# EAGLE design Zaq_ISO (EAGLE 6.5.0)
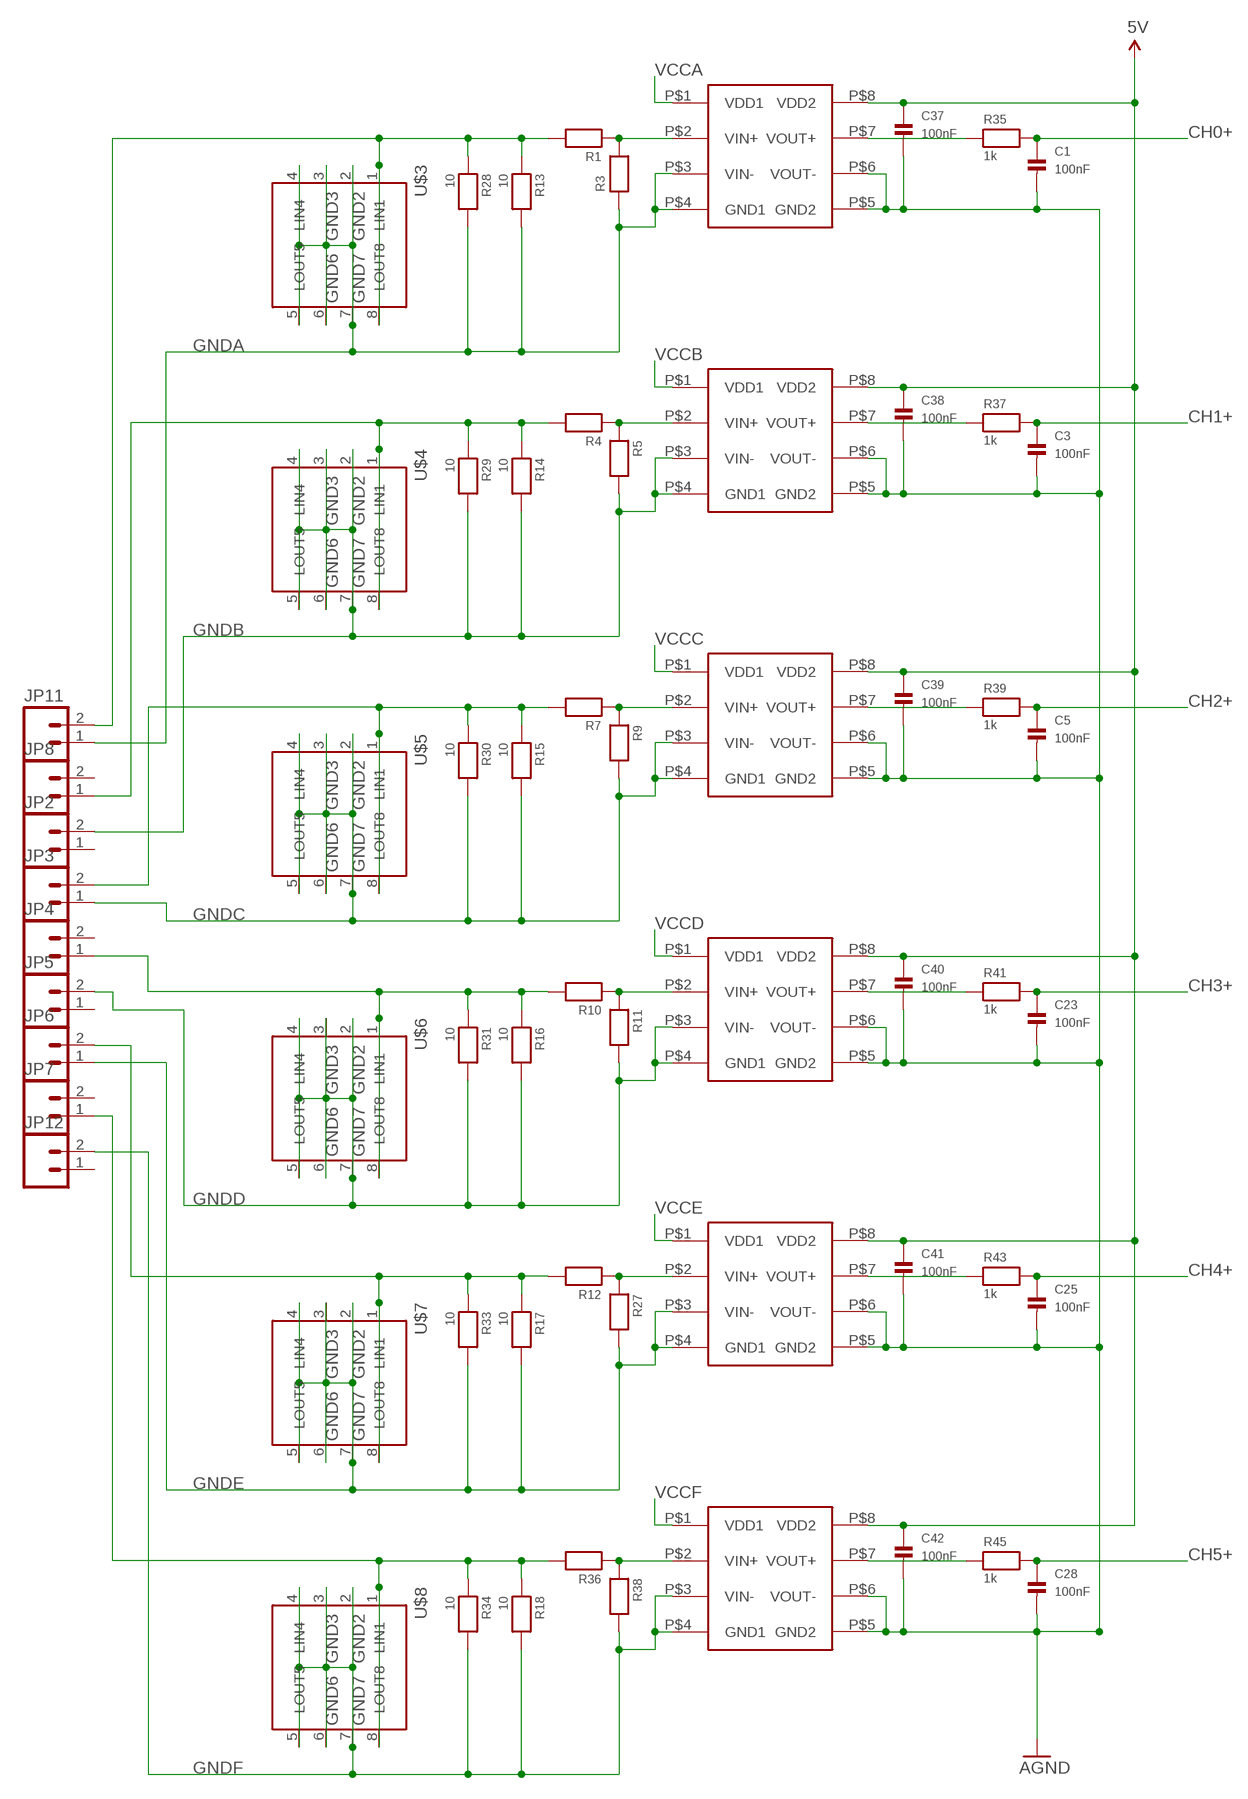
[diagram p0: schematic, sheet 1, part 1 of 2]
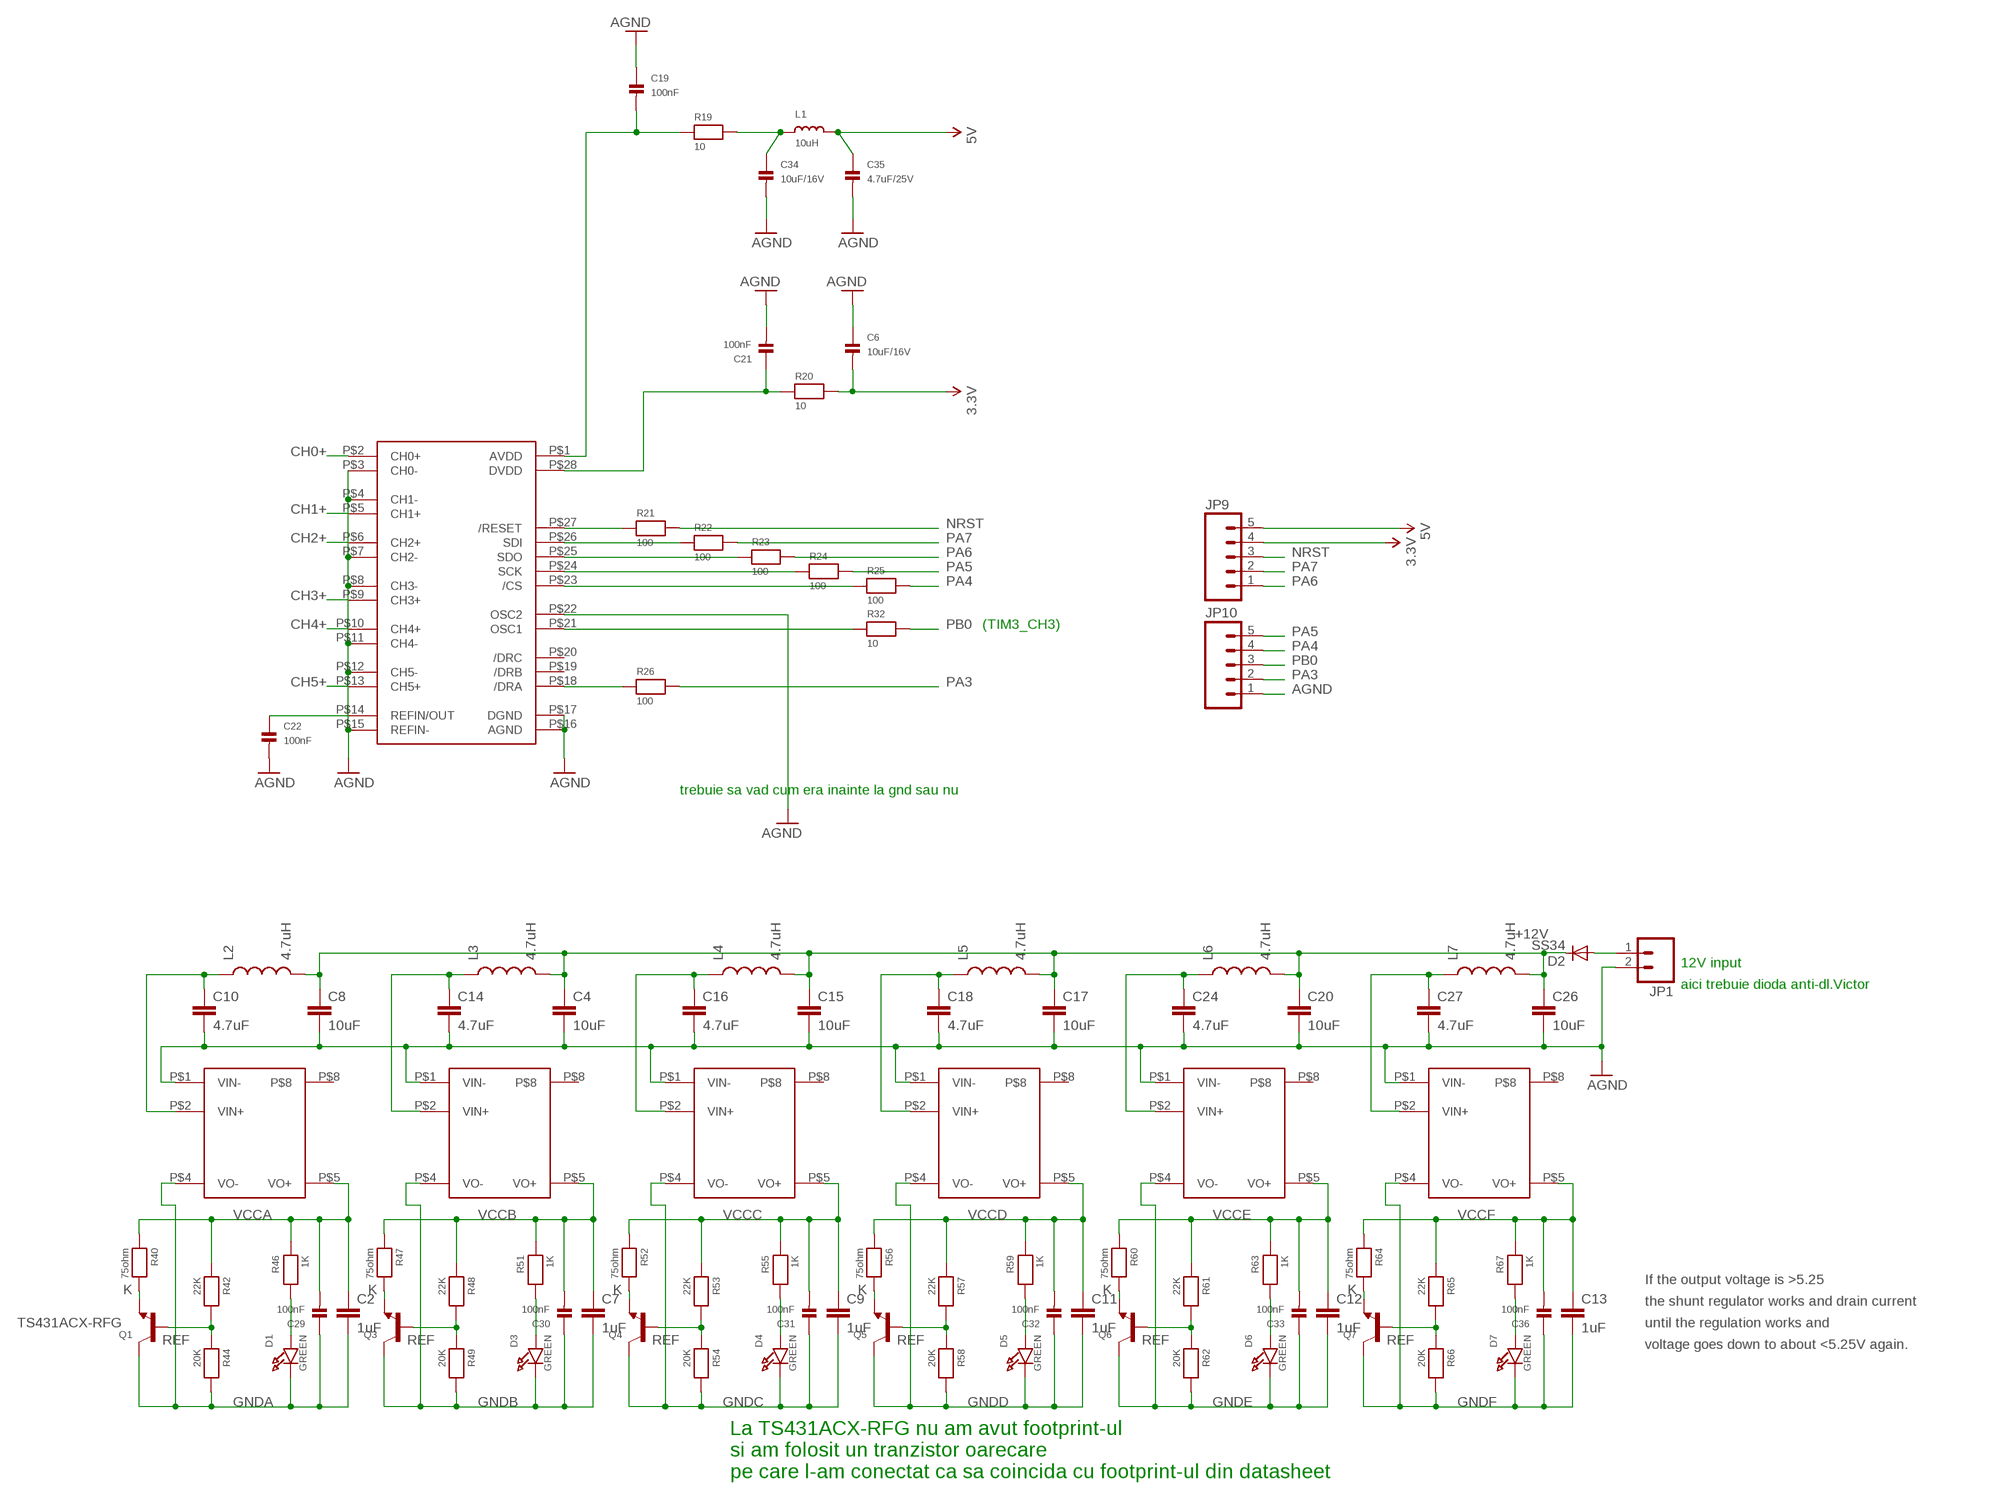
[diagram p1: schematic, sheet 1, part 2 of 2]

## Parts
.  MCP3903  [SSOP-28]
C1  100nF  CAP_CERAMIC_0805MP  [_0805MP]
C2  1uF  CAP1206  [1206]
C3  100nF  CAP_CERAMIC_0805MP  [_0805MP]
C4  10uF  CAP1206  [1206]
C5  100nF  CAP_CERAMIC_0805MP  [_0805MP]
C6  10uF/16V  CAP_CERAMIC_0805MP  [_0805MP]
C7  1uF  CAP1206  [1206]
C8  10uF  CAP1206  [1206]
C9  1uF  CAP1206  [1206]
C10  4.7uF  CAP1206  [1206]
C11  1uF  CAP1206  [1206]
C12  1uF  CAP1206  [1206]
C13  1uF  CAP1206  [1206]
C14  4.7uF  CAP1206  [1206]
C15  10uF  CAP1206  [1206]
C16  4.7uF  CAP1206  [1206]
C17  10uF  CAP1206  [1206]
C18  4.7uF  CAP1206  [1206]
C19  100nF  CAP_CERAMIC_0805MP  [_0805MP]
C20  10uF  CAP1206  [1206]
C21  100nF  CAP_CERAMIC_0805MP  [_0805MP]
C22  100nF  CAP_CERAMIC_0805MP  [_0805MP]
C23  100nF  CAP_CERAMIC_0805MP  [_0805MP]
C24  4.7uF  CAP1206  [1206]
C25  100nF  CAP_CERAMIC_0805MP  [_0805MP]
C26  10uF  CAP1206  [1206]
C27  4.7uF  CAP1206  [1206]
C28  100nF  CAP_CERAMIC_0805MP  [_0805MP]
C29  100nF  CAP_CERAMIC_0805MP  [_0805MP]
C30  100nF  CAP_CERAMIC_0805MP  [_0805MP]
C31  100nF  CAP_CERAMIC_0805MP  [_0805MP]
C32  100nF  CAP_CERAMIC_0805MP  [_0805MP]
C33  100nF  CAP_CERAMIC_0805MP  [_0805MP]
C34  10uF/16V  CAP_CERAMIC_0805MP  [_0805MP]
C35  4.7uF/25V  CAP_CERAMIC_0805MP  [_0805MP]
C36  100nF  CAP_CERAMIC_0805MP  [_0805MP]
C37  100nF  CAP_CERAMIC_0805MP  [_0805MP]
C38  100nF  CAP_CERAMIC_0805MP  [_0805MP]
C39  100nF  CAP_CERAMIC_0805MP  [_0805MP]
C40  100nF  CAP_CERAMIC_0805MP  [_0805MP]
C41  100nF  CAP_CERAMIC_0805MP  [_0805MP]
C42  100nF  CAP_CERAMIC_0805MP  [_0805MP]
D1  GREEN  LED0805_NOOUTLINE  [CHIPLED_0805_NOOUTLINE]
D2  SS34  DIODE-SMC  [SMC]
D3  GREEN  LED0805_NOOUTLINE  [CHIPLED_0805_NOOUTLINE]
D4  GREEN  LED0805_NOOUTLINE  [CHIPLED_0805_NOOUTLINE]
D5  GREEN  LED0805_NOOUTLINE  [CHIPLED_0805_NOOUTLINE]
D6  GREEN  LED0805_NOOUTLINE  [CHIPLED_0805_NOOUTLINE]
D7  GREEN  LED0805_NOOUTLINE  [CHIPLED_0805_NOOUTLINE]
JP1  M025MM  [SCREWTERMINAL-5MM-2]
JP2  M025MM  [SCREWTERMINAL-5MM-2]
JP3  M025MM  [SCREWTERMINAL-5MM-2]
JP4  M025MM  [SCREWTERMINAL-5MM-2]
JP5  M025MM  [SCREWTERMINAL-5MM-2]
JP6  M025MM  [SCREWTERMINAL-5MM-2]
JP7  M025MM  [SCREWTERMINAL-5MM-2]
JP8  M025MM  [SCREWTERMINAL-5MM-2]
JP9  M05PTH_LONGPADS  [1X05_LONGPADS]
JP10  M05PTH_LONGPADS  [1X05_LONGPADS]
JP11  M025MM  [SCREWTERMINAL-5MM-2]
JP12  M025MM  [SCREWTERMINAL-5MM-2]
L1  10uH  INDUCTOR_0805MP  [_0805MP]
L2  4.7uH  INDUCTOR1210  [1210]
L3  4.7uH  INDUCTOR1210  [1210]
L4  4.7uH  INDUCTOR1210  [1210]
L5  4.7uH  INDUCTOR1210  [1210]
L6  4.7uH  INDUCTOR1210  [1210]
L7  4.7uH  INDUCTOR1210  [1210]
Q1  TRANSISTOR_NPNWAVE  [SOT23-W]
Q3  TRANSISTOR_NPNWAVE  [SOT23-W]
Q4  TRANSISTOR_NPNWAVE  [SOT23-W]
Q5  TRANSISTOR_NPNWAVE  [SOT23-W]
Q6  TRANSISTOR_NPNWAVE  [SOT23-W]
Q7  TRANSISTOR_NPNWAVE  [SOT23-W]
R1  RESISTOR_0805MP  [_0805MP]
R3  RESISTOR_0805MP  [_0805MP]
R4  RESISTOR_0805MP  [_0805MP]
R5  RESISTOR_0805MP  [_0805MP]
R7  RESISTOR_0805MP  [_0805MP]
R9  RESISTOR_0805MP  [_0805MP]
R10  RESISTOR_0805MP  [_0805MP]
R11  RESISTOR_0805MP  [_0805MP]
R12  RESISTOR_0805MP  [_0805MP]
R13  10  RESISTOR1206  [1206]
R14  10  RESISTOR1206  [1206]
R15  10  RESISTOR1206  [1206]
R16  10  RESISTOR1206  [1206]
R17  10  RESISTOR1206  [1206]
R18  10  RESISTOR1206  [1206]
R19  10  RESISTOR_0805MP  [_0805MP]
R20  10  RESISTOR_0805MP  [_0805MP]
R21  100  RESISTOR_0805MP  [_0805MP]
R22  100  RESISTOR_0805MP  [_0805MP]
R23  100  RESISTOR_0805MP  [_0805MP]
R24  100  RESISTOR_0805MP  [_0805MP]
R25  100  RESISTOR_0805MP  [_0805MP]
R26  100  RESISTOR_0805MP  [_0805MP]
R27  RESISTOR_0805MP  [_0805MP]
R28  10  RESISTOR1206  [1206]
R29  10  RESISTOR1206  [1206]
R30  10  RESISTOR1206  [1206]
R31  10  RESISTOR1206  [1206]
R32  10  RESISTOR_0805MP  [_0805MP]
R33  10  RESISTOR1206  [1206]
R34  10  RESISTOR1206  [1206]
R35  1k  RESISTOR_0805MP  [_0805MP]
R36  RESISTOR_0805MP  [_0805MP]
R37  1k  RESISTOR_0805MP  [_0805MP]
R38  RESISTOR_0805MP  [_0805MP]
R39  1k  RESISTOR_0805MP  [_0805MP]
R40  75ohm  RESISTOR_0805MP  [_0805MP]
R41  1k  RESISTOR_0805MP  [_0805MP]
R42  22K  RESISTOR_0805MP  [_0805MP]
R43  1k  RESISTOR_0805MP  [_0805MP]
R44  20K  RESISTOR_0805MP  [_0805MP]
R45  1k  RESISTOR_0805MP  [_0805MP]
R46  1K  RESISTOR_0805MP  [_0805MP]
R47  75ohm  RESISTOR_0805MP  [_0805MP]
R48  22K  RESISTOR_0805MP  [_0805MP]
R49  20K  RESISTOR_0805MP  [_0805MP]
R51  1K  RESISTOR_0805MP  [_0805MP]
R52  75ohm  RESISTOR_0805MP  [_0805MP]
R53  22K  RESISTOR_0805MP  [_0805MP]
R54  20K  RESISTOR_0805MP  [_0805MP]
R55  1K  RESISTOR_0805MP  [_0805MP]
R56  75ohm  RESISTOR_0805MP  [_0805MP]
R57  22K  RESISTOR_0805MP  [_0805MP]
R58  20K  RESISTOR_0805MP  [_0805MP]
R59  1K  RESISTOR_0805MP  [_0805MP]
R60  75ohm  RESISTOR_0805MP  [_0805MP]
R61  22K  RESISTOR_0805MP  [_0805MP]
R62  20K  RESISTOR_0805MP  [_0805MP]
R63  1K  RESISTOR_0805MP  [_0805MP]
R64  75ohm  RESISTOR_0805MP  [_0805MP]
R65  22K  RESISTOR_0805MP  [_0805MP]
R66  20K  RESISTOR_0805MP  [_0805MP]
R67  1K  RESISTOR_0805MP  [_0805MP]
U$2  AMC1200SDUB  [SOP]
U$3  LC03_3V3  [SO8]
U$4  LC03_3V3  [SO8]
U$5  LC03_3V3  [SO8]
U$6  LC03_3V3  [SO8]
U$7  LC03_3V3  [SO8]
U$8  LC03_3V3  [SO8]
U$9  AMC1200SDUB  [SOP]
U$12  AMC1200SDUB  [SOP]
U$16  AMC1200SDUB  [SOP]
U$17  AM1LS-NJZ  [AM1LS-JZ]
U$18  AMC1200SDUB  [SOP]
U$19  AMC1200SDUB  [SOP]
U$20  AM1LS-NJZ  [AM1LS-JZ]
U$22  AM1LS-NJZ  [AM1LS-JZ]
U$23  AM1LS-NJZ  [AM1LS-JZ]
U$24  AM1LS-NJZ  [AM1LS-JZ]
U$25  AM1LS-NJZ  [AM1LS-JZ]

## Nets
3.3V: C6.2 JP9.4 R20.2
5V: C35.1 C37.1 C38.1 C39.1 C40.1 C41.1 C42.1 JP9.5 L1.2 U$2.P$8(VDD2) U$9.P$8(VDD2) U$12.P$8(VDD2) U$16.P$8(VDD2) U$18.P$8(VDD2) U$19.P$8(VDD2)
+12V: C4.1 C8.1 C15.1 C17.1 C20.1 C26.1 D2.C L2.2 L3.2 L4.2 L5.2 L6.2 L7.2
AGND: ..P$3(CH0-) ..P$4(CH1-) ..P$7(CH2-) ..P$8(CH3-) ..P$11(CH4-) ..P$12(CH5-) ..P$15(REFIN-) ..P$16(AGND) ..P$17(DGND) ..P$22(OSC2) C1.2 C3.2 C4.2 C5.2 C6.1 C8.2 C10.2 C14.2 C15.2 C16.2 C17.2 C18.2 C19.1 C20.2 C21.2 C22.2 C23.2 C24.2 C25.2 C26.2 C27.2 C28.2 C34.2 C35.2 C37.2 C38.2 C39.2 C40.2 C41.2 C42.2 JP1.2 JP10.1 U$2.P$5(GND2) U$2.P$6(VOUT-) U$9.P$5(GND2) U$9.P$6(VOUT-) U$12.P$5(GND2) U$12.P$6(VOUT-) U$16.P$5(GND2) U$16.P$6(VOUT-) U$17.P$1(VIN-) U$18.P$5(GND2) U$18.P$6(VOUT-) U$19.P$5(GND2) U$19.P$6(VOUT-) U$20.P$1(VIN-) U$22.P$1(VIN-) U$23.P$1(VIN-) U$24.P$1(VIN-) U$25.P$1(VIN-)
CH0+: ..P$2(CH0+) C1.1 R35.2
CH1+: ..P$5(CH1+) C3.1 R37.2
CH2+: ..P$6(CH2+) C5.1 R39.2
CH3+: ..P$9(CH3+) C23.1 R41.2
CH4+: ..P$10(CH4+) C25.1 R43.2
CH5+: ..P$13(CH5+) C28.1 R45.2
GNDA: C2.2 C29.1 D1.C JP11.1 Q1.3(C) R3.1 R13.2 R28.2 R44.2 U$2.P$3(VIN-) U$2.P$4(GND1) U$3.2(GND_2) U$3.3(GND_3) U$3.4(LIN4) U$3.5(LOUT5) U$3.6(GND_6) U$3.7(GND_7) U$17.P$4(VO-)
GNDB: C7.2 C30.1 D3.C JP2.2 Q3.3(C) R5.2 R14.2 R29.2 R49.2 U$4.2(GND_2) U$4.3(GND_3) U$4.4(LIN4) U$4.5(LOUT5) U$4.6(GND_6) U$4.7(GND_7) U$9.P$3(VIN-) U$9.P$4(GND1) U$20.P$4(VO-)
GNDC: C9.2 C31.1 D4.C JP3.1 Q4.3(C) R9.2 R15.2 R30.2 R54.2 U$5.2(GND_2) U$5.3(GND_3) U$5.4(LIN4) U$5.5(LOUT5) U$5.6(GND_6) U$5.7(GND_7) U$12.P$3(VIN-) U$12.P$4(GND1) U$22.P$4(VO-)
GNDD: C11.2 C32.1 D5.C JP5.2 Q5.3(C) R11.2 R16.2 R31.2 R58.2 U$6.2(GND_2) U$6.3(GND_3) U$6.4(LIN4) U$6.5(LOUT5) U$6.6(GND_6) U$6.7(GND_7) U$16.P$3(VIN-) U$16.P$4(GND1) U$23.P$4(VO-)
GNDE: C12.2 C33.1 D6.C JP6.1 Q6.3(C) R17.2 R27.2 R33.2 R62.2 U$7.2(GND_2) U$7.3(GND_3) U$7.4(LIN4) U$7.5(LOUT5) U$7.6(GND_6) U$7.7(GND_7) U$18.P$3(VIN-) U$18.P$4(GND1) U$24.P$4(VO-)
GNDF: C13.2 C36.1 D7.C JP12.2 Q7.3(C) R18.2 R34.2 R38.2 R66.2 U$8.2(GND_2) U$8.3(GND_3) U$8.4(LIN4) U$8.5(LOUT5) U$8.6(GND_6) U$8.7(GND_7) U$19.P$3(VIN-) U$19.P$4(GND1) U$25.P$4(VO-)
N$3: ..P$21(OSC1) R32.1
N$5: ..P$1(AVDD) C19.2 R19.1
N$7: Q1.1(B) R42.2 R44.1
N$8: ..P$14(REFIN/OUT) C22.1
N$9: ..P$28(DVDD) C21.1 R20.1
N$10: ..P$27(/RESET) R21.1
N$11: ..P$26(SDI) R22.1
N$12: ..P$25(SDO) R23.1
N$13: ..P$24(SCK) R24.1
N$14: ..P$23(/CS) R25.1
N$15: ..P$18(/DRA) R26.1
N$16: Q1.2(E) R40.2
N$17: C14.1 L3.1 U$20.P$2(VIN+)
N$18: D1.A R46.2
N$22: R45.1 U$19.P$7(VOUT+)
N$23: R43.1 U$18.P$7(VOUT+)
N$24: R41.1 U$16.P$7(VOUT+)
N$25: R39.1 U$12.P$7(VOUT+)
N$28: C34.1 L1.1 R19.2
N$29: R1.1 R3.2 U$2.P$2(VIN+)
N$30: R4.1 R5.1 U$9.P$2(VIN+)
N$31: R7.1 R9.1 U$12.P$2(VIN+)
N$32: R10.1 R11.1 U$16.P$2(VIN+)
N$33: R37.1 U$9.P$7(VOUT+)
N$34: R35.1 U$2.P$7(VOUT+)
N$35: Q3.1(B) R48.2 R49.1
N$36: Q3.2(E) R47.2
N$37: D3.A R51.2
N$39: R12.1 R27.1 U$18.P$2(VIN+)
N$40: R36.1 R38.1 U$19.P$2(VIN+)
N$42: Q4.1(B) R53.2 R54.1
N$43: Q4.2(E) R52.2
N$44: D4.A R55.2
N$46: D2.A JP1.1
N$47: Q5.1(B) R57.2 R58.1
N$48: Q5.2(E) R56.2
N$49: D5.A R59.2
N$51: JP7.1 R18.1 R34.1 R36.2 U$8.1(LIN1) U$8.8(LOUT8)
N$53: JP6.2 R12.2 R17.1 R33.1 U$7.1(LIN1) U$7.8(LOUT8)
N$54: JP4.1 R10.2 R16.1 R31.1 U$6.1(LIN1) U$6.8(LOUT8)
N$55: Q6.1(B) R61.2 R62.1
N$56: Q6.2(E) R60.2
N$57: JP3.2 R7.2 R15.1 R30.1 U$5.1(LIN1) U$5.8(LOUT8)
N$58: JP8.1 R4.2 R14.1 R29.1 U$4.1(LIN1) U$4.8(LOUT8)
N$59: D6.A R63.2
N$60: JP11.2 R1.2 R13.1 R28.1 U$3.1(LIN1) U$3.8(LOUT8)
N$63: Q7.1(B) R65.2 R66.1
N$64: Q7.2(E) R64.2
N$65: D7.A R67.2
N$74: C27.1 L7.1 U$25.P$2(VIN+)
N$76: C24.1 L6.1 U$24.P$2(VIN+)
N$78: C18.1 L5.1 U$23.P$2(VIN+)
N$80: C10.1 L2.1 U$17.P$2(VIN+)
N$82: C16.1 L4.1 U$22.P$2(VIN+)
NRST: JP9.3 R21.2
PA3: JP10.2 R26.2
PA4: JP10.4 R25.2
PA5: JP10.5 R24.2
PA6: JP9.1 R23.2
PA7: JP9.2 R22.2
PB0: JP10.3 R32.2
VCCA: C2.1 C29.2 R40.1 R42.1 R46.1 U$2.P$1(VDD1) U$17.P$5(VO+)
VCCB: C7.1 C30.2 R47.1 R48.1 R51.1 U$9.P$1(VDD1) U$20.P$5(VO+)
VCCC: C9.1 C31.2 R52.1 R53.1 R55.1 U$12.P$1(VDD1) U$22.P$5(VO+)
VCCD: C11.1 C32.2 R56.1 R57.1 R59.1 U$16.P$1(VDD1) U$23.P$5(VO+)
VCCE: C12.1 C33.2 R60.1 R61.1 R63.1 U$18.P$1(VDD1) U$24.P$5(VO+)
VCCF: C13.1 C36.2 R64.1 R65.1 R67.1 U$19.P$1(VDD1) U$25.P$5(VO+)
Unconnected: ..P$19(/DRB) ..P$20(/DRC) JP2.1 JP4.2 JP5.1 JP7.2 JP8.2 JP12.1 U$17.P$8 U$20.P$8 U$22.P$8 U$23.P$8 U$24.P$8 U$25.P$8

## Notes on the sheet
- (TIM3_CH3)
- trebuie sa vad cum era inainte la gnd sau nu
- 12V input
- aici trebuie dioda anti-dl.Victor
- K | K | K | K | K | K | If the output voltage is >5.25
- the shunt regulator works and drain current
- TS431ACX-RFG | until the regulation works and
- REF | REF | REF | REF | REF | REF
- voltage goes down to about <5.25V again.
- La TS431ACX-RFG nu am avut footprint-ul
- si am folosit un tranzistor oarecare
- pe care l-am conectat ca sa coincida cu footprint-ul din datasheet

## Library data of the parts
. = ecgparts:MCP3903
C1 C3 C5 C6 C19 C21-C23 C25 C28-C42 = microbuilder:CAP_CERAMIC: Ceramic Capacitors 0402 - 0402 Surface Mount Capacitors 16pF 50V 5% [Digikey: 445-4899-2-ND] 18pF 50V 5% [Digikey: 490-1281-2-ND] 22pF 50V 5% [Digikey: 490-1283-2-ND] 68pF 50V 5% [Digikey: 490-1289-2-ND] 0.1uF 10V 10% [Digikey: 490-1318-2-ND] 1.0uF 6.3V 10% [Digikey: 490-1320-2-ND] 0603 - 0603 Surface Mount Capacitors 16 pF 50V 5% [Digikey: 445-5051-2-ND] 22 pF 50V [Digikey: PCC220ACVTR-ND] 33 pF 50V 5% [Digikey: 490-1415-1-ND] 56pF 50V 5% [Digikey: 490-1421-1-ND] 220pF 50V 5% [Digikey: 445-1285-1-ND] 680 pF 50V 2200 pF 50V 5% C0G [Digikey: 445-1297-1-ND] 5600 pF 100V 5% X7R [Digikey: 478-3711-1-ND] 0.1 µF 25V 10% [Digikey: PCC2277TR-ND] 0.22 µF 16V 10% X7R [Digikey: 445-1318-1-ND] 1.0 µF 25V 10% [Digikey: 445-5146-2-ND] 0603 - RF Specific 3pF 250V +/-0.1pF RF [Digikey: 712-1347-1-ND] 18 pF 250V 5% [Digikey: 478-3505-1-ND or 712-1322-1-ND] 56 pF 250V 5% C0G RF [Digikey: 490-4867-1-ND] 68 pF 250V RF [Digikey: 490-4868-1-ND] 0805 - 0805 Surface Mount Capacitors 220 pF 250V 2% RF Ceramic Capacitor [Digikey: 712-1398-1-ND] 1000 pF 50V 2% NP0 Ceramic Capacitor [Digikey: 478-3760-1-ND] 0.1 µF 25V 10% Ceramic Capacitor [Digikey: PCC1828TR-ND] 1.0 µF 16V 10% Ceramic Capacitor[Digikey: 490-1691-2-ND] 10.0 µF 10V 10% Ceramic Capacitor[Digikey: 709-1228-1-ND] 10.0 uF 16V 10% Ceramic Capacitor [Digikey: 478-5165-2-ND] 47 uF 6.3V 20% Ceramic Capacitor [Digikey: 587-1779-1-ND or 399-5506-1-ND] 1206 - 1206 Surface Mount Capacitors 47uF 10V 20% Ceramic Capacitor [Digikey: 490-5528-1-ND or 399-5508-1-ND or 445-6010-1-ND] 100uF 6.3V -20%, +80% Y5V Ceramic Capacitor (Digikey: 490-4512-1-ND, Mouser: 81-GRM31CF50J107ZE1L)
C2 C4 C7-C18 C20 C24 C26 C27 = SparkFun-Passives:CAP: Capacitor Standard 0603 ceramic capacitor, and 0.1" leaded capacitor.
D1 D3-D7 = microbuilder:LED: LED 0603 - 0603 Surface Mount Package 2mA: Green LED - Low Power (3.9mcd, 2ma, 1.7Vf) - Digikey: 475-2709-2-ND Orange LED - Low Power (9.8mcd, 2ma, 1.8Vf) - Digikey: 475-1194-2-ND Red LED - Low Power (5mcd, 2ma, 1.8Vf) - Digikey: 475-1195-2-ND Yellow LED - Low Power (7mcd, 2ma, 1.8Vf) - Digikey: 475-1196-2-ND 5mA: Blue LED - Low Power (17mcd, 5ma, 2.9Vf) - Digikey: LNJ937W8CRACT-ND 0805 - 0805 Surface Mount Package 2mA: Red LED (8.8mcd, 2mA, 1.8Vf, Clear) - Low Power [Digikey: 475-2510-1-ND] Green LED (5mcd, 2mA, 1.8Vf, Clear) - Low Power [Digikey: 475-2730-1-ND] Yellow LED (11.3mcd, 2mA, 1.8Vf, Clear) - Low Power [Digikey: 475-2555-1-ND] 20mA: Red LED (104mcd, 20mA, Diffused) - LS R976 [Digikey: 475-1278-6-ND] Red LED (12mcd, 20mA, 2.0Vf, Clear) - APT2012EC [Digikey: 754-1128-1-ND] Green LED (15mcd, 20mA, 2.2Vf, Clear) - APT2012GC [Digikey: 754-1131-1-ND] Orange LED (160mcd, 20mA, 2.1Vf, Clear) - APT2012SECK [Digikey: 754-1130-1-ND] 1206 - 1206 Surface Mount Package Green LED (26mcd, 20mA, Diffused) - LG N971 [Digikey: 475-1407-6-ND] Red LED (15mcd, 20mA, Diffused) - LH N974 [Digikey: 475-1416-6-ND]
D2 = diode:DIODE-: DIODE
JP1-JP8 JP11 JP12 = SparkFun-Connectors:M02: Header 2 Standard 2-pin 0.1" header. Use with straight break away headers (SKU : PRT-00116), right angle break away headers (PRT-00553), swiss pins (PRT-00743), machine pins (PRT-00117), and female headers (PRT-00115). Molex polarized connector foot print use with SKU : PRT-08233 with associated crimp pins and housings.
JP9 JP10 = SparkFun-Connectors:M05: Header 5 Standard 5-pin 0.1" header. Use with straight break away headers (SKU : PRT-00116), right angle break away headers (PRT-00553), swiss pins (PRT-00743), machine pins (PRT-00117), and female headers (PRT-00115). Molex polarized connector foot print use with SKU : PRT-08230 with associated crimp pins and housings.
L1 = microbuilder:INDUCTOR: Inductors
L2-L7 = SparkFun-Passives:INDUCTOR: Inductors
Q1 Q3-Q7 = microbuilder:TRANSISTOR_NPN: NPN Transistor Transistor (NPN) 500mA 45V - BC817 [Digikey: 568-1631-1-ND] Transistor (NPN) 500mA 45V - BC817,215 [Mouser: 771-BC817-T/R] SOT23-R - SOT23 footprint optimised for use with solder paste and reflow ovens. SOT23-W - SOT23 footprint optimised for hand-soldering (larger pads).
R1 R3-R5 R7 R9-R49 R51-R67 = microbuilder:RESISTOR: Resistors 0402 - 0402 Surface Mount Package 22 Ohm 1% 1/16W [Digikey: 311-22.0LRTR-ND] 33 Ohm 5% 1/16W 1.0K 5% 1/16W 1.5K 5% 1/16W 2.0K 1% 1/16W 10.0K 1% 1/16W [Digikey: 311-10.0KLRTR-ND] 10.0K 5% 1/16W [Digikey: RMCF0402JT10K0TR-ND] 12.1K 1% 1/16W [Digikey: 311-22.0LRTR-ND] 100.0K 5% 1/16W 0603 - 0603 Surface Mount Package 0 Ohm 1/10 Watt 1% Resistor 15 Ohm 1/10 Watt 1% Resistor 33 Ohm 1/10 Watt 1% Resistor 49.9 Ohm 1/10 Watt 1% Resistor 100 Ohm 1/10 Watt 1% Resistor 150 Ohm 1/10 Watt 1% Resistor 240 Ohm 1/10 Watt 1% Resistor 390 Ohm 1/10 Watt 1% Resistor 560 Ohm 1/10 Watt 1% Resistor 680 Ohm 1/10 Watt 1% Resistor 750 Ohm 1/10 Watt 1% Resistor 1.0K Ohm 1/10 Watt 1% Resistor 1.5K Ohm 1/10 Watt 1% Resistor 2.0K Ohm 1/10 Watt 1% Resistor 2.2K Ohm 1/10 Watt 1% Resistor 3.3K Ohm 1/10 Watt 1% Resistor 4.7K Ohm 1/10 Watt 1% Resistor 10.0K Ohm 1/10 Watt 1% Resistor 12.0K Ohm 1/10 Watt 1% Resistor 12.1K Ohm 1/10 Watt 1% Resistor 20.0K Ohm 1/10 Watt 1% Resistor 33.0K Ohm 1/10 Watt 1% Resistor 100.0K Ohm 1/10 Watt 1% Resistor 0805 - 0805 Surface Mount Package 0 Ohm 1/8 Watt 1% Resistor 33 Ohm 1/8 Watt 1% Resistor 100 Ohm 1/8 Watt 1% Resistor 150 Ohm 1/8 Watt 1% Resistor 200 Ohm 1/8 Watt 1% Resistor 240 Ohm 1/8 Watt 1% Resistor 330 Ohm 1/8 Watt 1% Resistor 390 Ohm 1/8 Watt 1% Resistor 470 Ohm 1/8 Watt 1% Resistor 1.0K Ohm 1/8 Watt 1% Resistor 1.5K Ohm 1/8 Watt 1% Resistor 2.0K Ohm 1/8 Watt 1% Resistor 4.7K Ohm 1/8 Watt 1% Resistor 5.1K Ohm 1/8 Watt 1% Resistor 5.6K Ohm 1/8 Watt 1% Resistor 10.0K Ohm 1/8 Watt 1% Resistor 22.0K Ohm 1/8 Watt 1% Resistor 33.0K Ohm 1/8 Watt 1% Resistor 100K Ohm 1/8 Watt 1% Resistor 1206 - 1206 Surface Mount Package 2012 - 2010 Surface Mount Package 0.11 Ohm 1/2 Watt 1% Resistor - Digikey: RHM.11UCT-ND
U$2 U$9 U$12 U$16 U$18 U$19 = LibrarieEagleNedelcu:AMC1200SDUB
U$3-U$8 = LC03_3v3:LC03_3V3
U$17 U$20 U$22-U$25 = LibrarieEagleNedelcu:AM1LS-NJZ

## Board
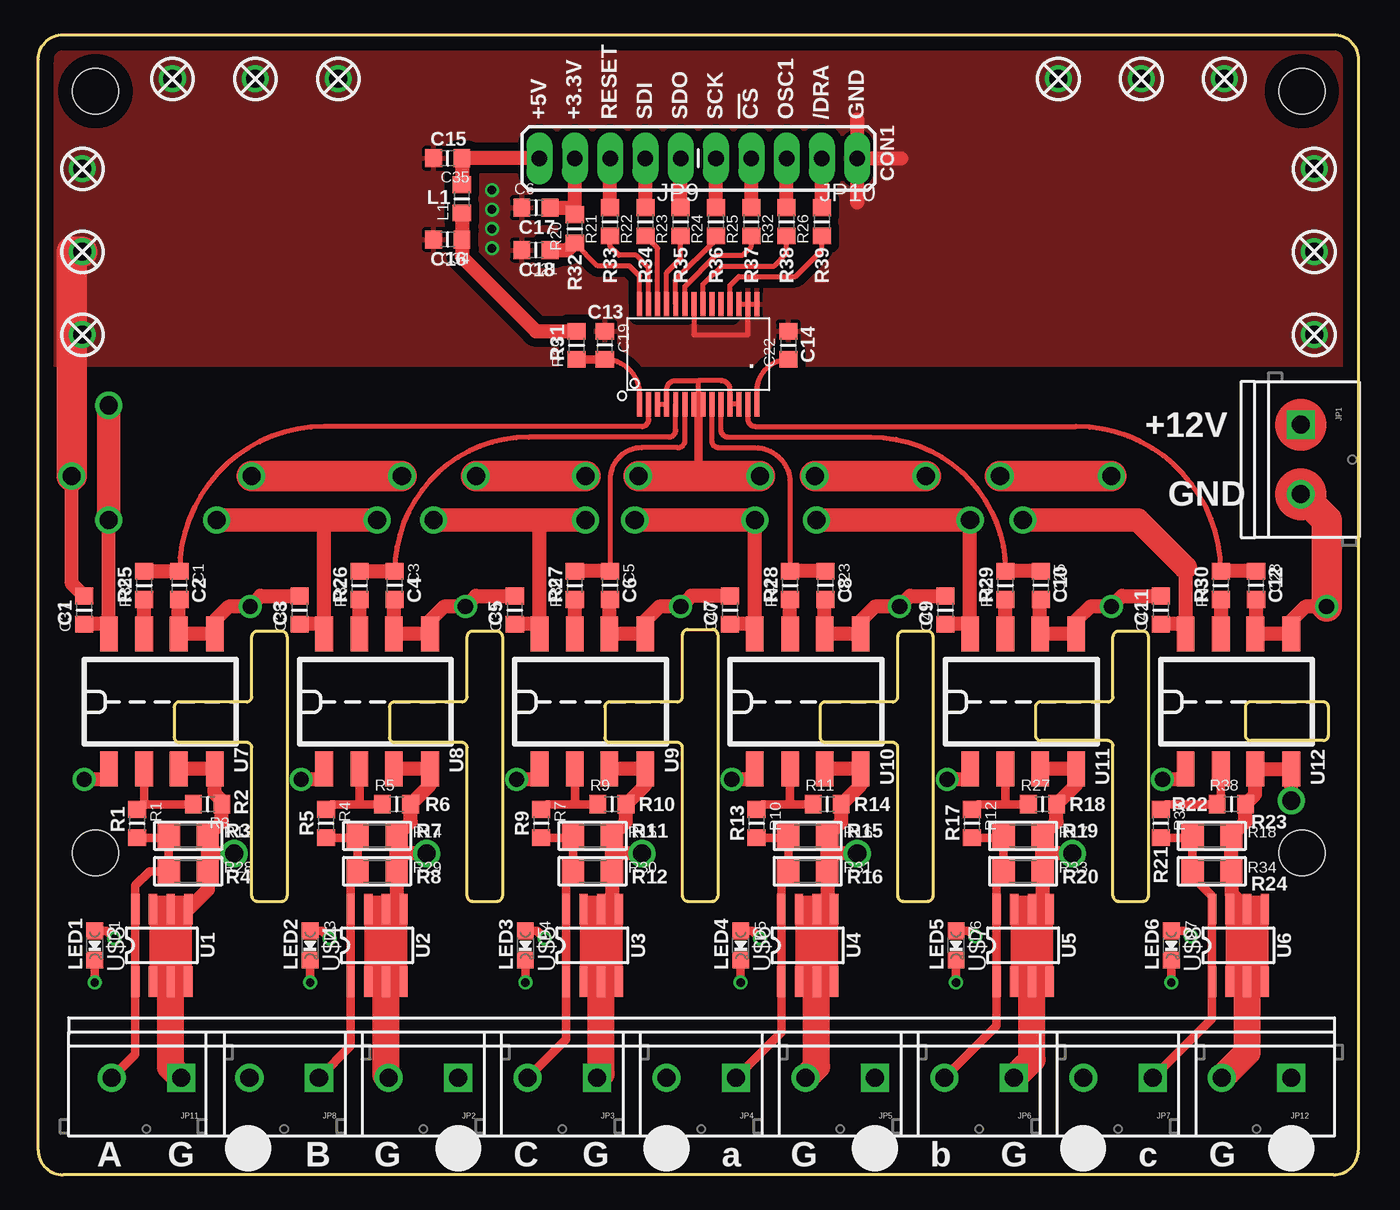
[diagram p2: board, top side]
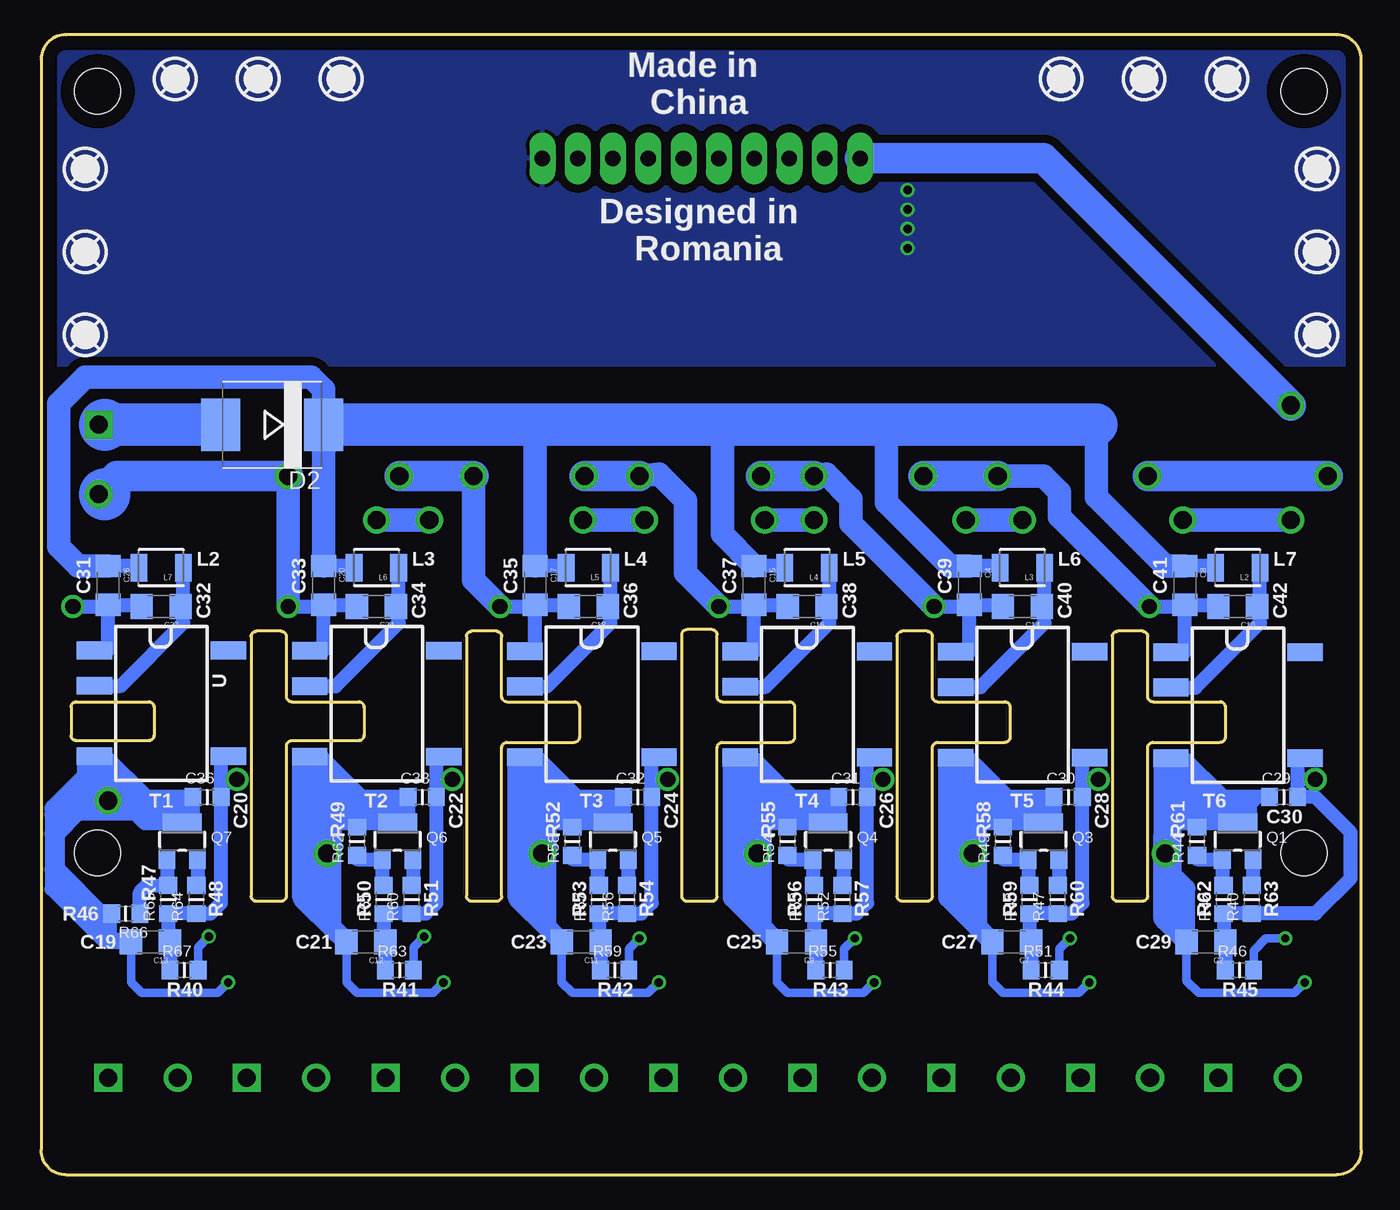
[diagram p3: board, bottom side, seen from below]

Size 95 x 82.04 mm. Coordinates in mm from the lower left corner, seen from the top.
Outline: 0,1.78 0,80.26 arc-90 1.78,82.04 93.22,82.04 arc-90 95,80.26 95,1.78 arc-90 93.22,0 1.78,0 arc-90 0,1.78
Outline: 30.86,20.07 arc90 31.24,19.68 33.02,19.68 arc90 33.4,20.07 33.4,38.73 arc90 33.02,39.12 31.24,39.12 arc90 30.86,38.73 30.86,34.42 arc-90 30.48,34.04 25.65,34.04 arc90 25.27,33.66 25.27,31.5 arc90 25.65,31.11 30.48,31.11 arc-90 30.86,30.73 30.86,20.07
Outline: 15.37,20.07 arc90 15.75,19.68 17.53,19.68 arc90 17.91,20.07 17.91,38.73 arc90 17.53,39.12 15.75,39.12 arc90 15.37,38.73 15.37,34.42 arc-90 14.99,34.04 10.16,34.04 arc90 9.78,33.66 9.78,31.5 arc90 10.16,31.11 14.99,31.11 arc-90 15.37,30.73 15.37,20.07
Outline: 61.85,20.07 arc90 62.23,19.68 64.01,19.68 arc90 64.39,20.07 64.39,38.73 arc90 64.01,39.12 62.23,39.12 arc90 61.85,38.73 61.85,34.42 arc-90 61.47,34.04 56.64,34.04 arc90 56.26,33.66 56.26,31.5 arc90 56.64,31.11 61.47,31.11 arc-90 61.85,30.73 61.85,20.07
Outline: 46.35,20.07 arc90 46.74,19.68 48.51,19.68 arc90 48.9,20.07 48.9,38.86 arc90 48.51,39.24 46.74,39.24 arc90 46.35,38.86 46.35,34.42 arc-90 45.97,34.04 41.15,34.04 arc90 40.77,33.66 40.77,31.5 arc90 41.15,31.11 45.97,31.11 arc-90 46.35,30.73 46.35,20.07
Outline: 77.34,20.07 arc90 77.72,19.68 79.5,19.68 arc90 79.88,20.07 79.88,38.73 arc90 79.5,39.12 77.72,39.12 arc90 77.34,38.73 77.34,34.42 arc-90 76.96,34.04 72.14,34.04 arc90 71.75,33.66 71.75,31.62 arc90 72.14,31.24 76.96,31.24 arc-90 77.34,30.86 77.34,20.07
Outline: 92.46,34.04 87.25,34.04 arc90 86.87,33.66 86.87,31.62 arc90 87.25,31.24 92.46,31.24 arc90 92.84,31.62 92.84,33.66 arc90 92.46,34.04
Copper layers (1*16): Top 0.035mm / dielectric 1.5mm / Bottom 0.035mm
Design rules "default *": minimum track width 10mil, minimum drill 24mil, track to track 8mil, track to pad 8mil, pad to pad 8mil, via to via 8mil, smd to smd 8mil, copper to edge 40mil, drill to drill 8mil, minimum pad ring 10mil, minimum via ring 8mil, stop-mask expansion 4mil, vias tented up to drill 0mil, thermal gap 10mil

### Footprints (pad centres in the part's own frame; a part is rotated, then mirrored left to right if it is on the bottom)
SSOP-28 = smd 1.75 x 0.356: P$1 -3.6,4.225; P$2 -3.6,3.575; P$3 -3.6,2.925; P$4 -3.6,2.275; P$5 -3.6,1.625; P$6 -3.6,0.975; P$7 -3.6,0.325; P$8 -3.6,-0.325; P$9 -3.6,-0.975; P$10 -3.6,-1.625; P$11 -3.6,-2.275; P$12 -3.6,-2.925; P$13 -3.6,-3.575; P$14 -3.6,-4.225; P$15 3.6,-4.225; P$16 3.6,-3.575; P$17 3.6,-2.925; P$18 3.6,-2.275; P$19 3.6,-1.625; P$20 3.6,-0.975; P$21 3.6,-0.325; P$22 3.6,0.325; P$23 3.6,0.975; P$24 3.6,1.625; P$25 3.6,2.275; P$26 3.6,2.925; P$27 3.6,3.575; P$28 3.6,4.225
_0805MP = smd 1.2 x 1.3: 1 -1.016,0; 2 1.016,0
1206 = smd 1.6 x 1.8: 1 -1.4,0; 2 1.4,0
CHIPLED_0805_NOOUTLINE = smd 1.2 x 1.2: A 0,-1.05; C 0,1.05
SMC = smd 2.8 x 3.8: A 3.7,0; C -3.7,0
SCREWTERMINAL-5MM-2 = drill 1.3 pad 2.032 square: 1 0,0 | drill 1.3 pad 2.032: 2 5,0
1X05_LONGPADS = drill 1.118 pad 1.88 long: 1 0,0; 2 2.54,0; 3 5.08,0; 4 7.62,0; 5 10.16,0
1210 = smd 1.2 x 2: 1 -1.6,0; 2 1.6,0
SOT23-W = smd 1.2 x 1.4: 1 -1.1,-1.3; 2 1.1,-1.3 | smd 2.8 x 1.4: 3 0,1.3
STAND-OFF = hole 3.302: 0,0
SOP = smd 2.54 x 1.27: P$1 -4.826,3.81; P$2 -4.826,1.27; P$3 -4.826,-1.216; P$4 -4.826,-3.81; P$5 4.877,-3.81; P$6 4.877,-1.216; P$7 4.877,1.27; P$8 4.877,3.81
SO8 = smd 0.6 x 2.2: 1 -1.905,-2.6; 2 -0.635,-2.6; 3 0.635,-2.6; 4 1.905,-2.6; 5 1.905,2.6; 6 0.635,2.6; 7 -0.635,2.6; 8 -1.905,2.6
AM1LS-JZ = smd 2.54 x 1.27: P$1 -1.53,9.26; P$2 -1.53,6.72; P$4 -1.53,1.64; P$5 8.12,1.64; P$8 8.12,9.26

### Placement (x,y rotation side)
.  47.5,59.05 90 top
C1  10.16,42.42 270 top
C2  11.18,16.76 180 bottom
C3  25.65,42.42 270 top
C4  28.19,42.42 270 bottom
C5  41.15,42.42 270 top
C6  35.81,69.6 0 top
C7  25.15,16.76 180 bottom
C8  12.7,42.42 270 bottom
C9  40.64,16.76 180 bottom
C10  8.89,40.89 180 bottom
C11  56.13,16.76 180 bottom
C12  71.63,16.76 180 bottom
C13  87.12,16.76 180 bottom
C14  24.38,40.89 180 bottom
C15  43.69,42.42 270 bottom
C16  39.88,40.89 180 bottom
C17  59.44,42.42 270 bottom
C18  55.63,40.89 180 bottom
C19  40.77,59.69 270 top
C20  74.68,42.42 270 bottom
C21  35.81,66.55 180 top
C22  53.98,59.69 90 top
C23  56.64,42.42 270 top
C24  70.87,40.89 180 bottom
C25  72.14,42.42 270 top
C26  90.17,42.42 270 bottom
C27  86.36,40.89 180 bottom
C28  87.63,42.42 270 top
C29  5.59,27.18 0 bottom
C30  21.08,27.18 0 bottom
C31  36.58,27.18 0 bottom
C32  52.07,27.18 0 bottom
C33  67.56,27.18 0 bottom
C34  29.46,67.31 180 top
C35  29.46,73.15 180 top
C36  83.06,27.18 0 bottom
C37  3.3,40.64 90 top
C38  18.8,40.64 90 top
C39  34.29,40.64 90 top
C40  49.78,40.64 90 top
C41  65.28,40.64 90 top
C42  80.77,40.64 90 top
D1  4.06,16.51 180 top
D2  78.36,53.98 180 bottom
D3  19.56,16.51 180 top
D4  35.05,16.51 180 top
D5  50.55,16.51 180 top
D6  66.04,16.51 180 top
D7  81.53,16.51 180 top
JP1  90.86,53.98 270 top
JP2  30.21,6.98 180 top
JP3  40.21,6.98 180 top
JP4  50.21,6.98 180 top
JP5  60.21,6.98 180 top
JP6  70.21,6.98 180 top
JP7  80.21,6.98 180 top
JP8  20.19,6.99 180 top
JP9  46.23,73.15 180 top
JP10  58.93,73.15 180 top
JP11  10.29,6.99 180 top
JP12  90.17,6.99 180 top
L1  30.48,70.23 90 top
L2  8.89,43.69 180 bottom
L3  24.38,43.69 180 bottom
L4  39.88,43.69 180 bottom
L5  55.63,43.69 180 bottom
L6  70.87,43.69 180 bottom
L7  86.36,43.69 180 bottom
Q1  8.89,24 0 bottom
Q3  22.86,24 0 bottom
Q4  38.35,24 0 bottom
Q5  53.85,24 0 bottom
Q6  69.34,24 0 bottom
Q7  84.84,24 0 bottom
R1  7.11,25.27 270 top
R3  12.19,26.67 180 top
R4  20.7,25.27 270 top
R5  25.78,26.67 0 top
R7  36.2,25.27 270 top
R9  41.27,26.67 0 top
R10  51.69,25.27 270 top
R11  56.77,26.67 0 top
R12  67.18,25.27 270 top
R13  10.79,24.38 0 top
R14  24.38,24.38 0 top
R15  39.88,24.38 0 top
R16  55.37,24.38 0 top
R17  70.87,24.38 0 top
R18  84.45,24.38 0 top
R19  38.73,59.69 90 top
R20  38.61,68.07 90 top
R21  41.15,68.58 90 top
R22  43.69,68.58 90 top
R23  46.23,68.58 90 top
R24  48.77,68.58 90 top
R25  51.31,68.58 90 top
R26  56.39,68.58 90 top
R27  72.26,26.67 0 top
R28  10.79,21.84 0 top
R29  24.38,21.84 0 top
R30  39.88,21.84 0 top
R31  55.37,21.84 0 top
R32  53.85,68.58 90 top
R33  70.87,21.84 0 top
R34  84.45,21.84 0 top
R35  7.62,42.42 90 top
R36  80.77,25.27 270 top
R37  23.11,42.42 90 top
R38  85.85,26.67 0 top
R39  38.61,42.42 90 top
R40  7.87,19.81 90 bottom
R41  54.1,42.42 90 top
R42  9.91,19.81 90 bottom
R43  69.6,42.42 90 top
R44  11.81,24 90 bottom
R45  85.09,42.42 90 top
R46  8.76,14.73 0 bottom
R47  21.84,19.81 90 bottom
R48  23.88,19.81 90 bottom
R49  25.78,24 90 bottom
R51  22.73,14.73 0 bottom
R52  37.34,19.81 90 bottom
R53  39.37,19.81 90 bottom
R54  41.27,24 90 bottom
R55  38.23,14.73 0 bottom
R56  52.83,19.81 90 bottom
R57  54.86,19.81 90 bottom
R58  56.77,24 90 bottom
R59  53.72,14.73 0 bottom
R60  68.33,19.81 90 bottom
R61  70.36,19.81 90 bottom
R62  72.26,24 90 bottom
R63  69.22,14.73 0 bottom
R64  83.82,19.81 90 bottom
R65  85.85,19.81 90 bottom
R66  88.9,18.8 180 bottom
R67  84.71,14.73 0 bottom
STANDOFF1  STAND-OFF  [STAND-OFF]  90.93,23.16 0 top
STANDOFF6  STAND-OFF  [STAND-OFF]  4.11,77.98 0 top
STANDOFF10  STAND-OFF  [STAND-OFF]  90.93,77.98 0 top
STANDOFF12  STAND-OFF  [STAND-OFF]  4.11,23.16 0 top
U$2  8.89,34.04 90 top
U$3  8.89,16.51 0 top
U$4  24.38,16.51 0 top
U$5  39.88,16.51 0 top
U$6  55.37,16.51 0 top
U$7  70.87,16.51 0 top
U$8  86.36,16.51 0 top
U$9  24.38,34.04 90 top
U$12  39.88,34.04 90 top
U$16  55.37,34.04 90 top
U$17  12.17,28.35 0 bottom
U$18  70.87,34.04 90 top
U$19  86.36,34.04 90 top
U$20  27.66,28.37 0 bottom
U$22  43.15,28.4 0 bottom
U$23  58.65,28.42 0 bottom
U$24  74.14,28.45 0 bottom
U$25  89.64,28.47 0 bottom

### Tracks (layer width: path | path; a pad name or v marks a point on that pad's centre or on a via)
3.3V
  Top 1.016: JP9.4 R20.2 38.1,69.6 C6.2
5V  (via drill 1.3)
  Top 1.016: U$19.P$8 82.55,39.62 | 82.55,39.62 C42.1 | U$18.P$8 67.06,39.62 | 67.06,39.62 C41.1 | U$16.P$8 51.56,39.62 | 51.56,39.62 C40.1 | U$12.P$8 36.07,39.62 | 36.07,39.62 C39.1 | U$9.P$8 20.57,39.62 | 20.57,39.62 C38.1 | U$2.P$8 5.08,39.62 | 5.08,39.62 C37.1 | 20.57,39.62 20.57,46.99 20.7,47.12 | 36.07,39.62 36.07,46.99 35.94,47.12 | 51.56,39.62 51.56,44.96 v51.56,47.11 | 67.06,39.62 v67.06,47.12 | 82.55,43.69 82.55,39.62 | 5.08,39.62 v5.08,47.12 | JP9.5 C35.1 L1.2
  Top 1.676: v39.37,47.12 35.94,47.12 v28.45,47.12 | v24.38,47.12 20.7,47.12 v12.83,47.12 | v67.06,47.12 v56.01,47.12 | 82.55,43.69 79.12,47.12 v70.87,47.12 | v42.93,47.12 v42.93,47.11 v51.56,47.11 v51.56,47.12 | v5.08,47.12 v5.08,55.37
  Bottom 1.676: v42.93,47.12 v39.37,47.12 | v28.45,47.12 v24.38,47.12 | v12.83,47.12 v5.08,47.12 | v56.01,47.12 v51.56,47.12 | v67.06,47.12 v70.87,47.12
  Bottom 2.184: JP9.5 22.86,73.15 v5.08,55.37
+12V
  Bottom 1.016: L7.2 87.96,43.82 C26.1 90.3,43.82 | L6.2 72.47,43.82 C20.1 | L5.2 57.23,43.82 C17.1 | L4.2 41.48,43.82 C15.1 | L3.2 25.98,43.82 C4.1 | L2.2 10.49,43.82 C8.1
  Bottom 1.676: C20.1 74.68,53.98 D2.C 74.68,53.99 74.68,56.52 75.56,57.4 91.82,57.4 93.73,55.5 93.73,45.21 92.33,43.82 C26.1 | C17.1 59.44,53.98 | 45.97,53.98 45.97,46.1 C15.1 | C4.1 29.59,43.82 34.16,48.39 34.16,53.98 | C8.1 14.1,43.82 19.05,48.77 19.05,53.98
  Bottom 1.778: 73.66,53.98 D2.C
  Bottom 3.048: 73.66,53.98 59.44,53.98 45.97,53.98 34.16,53.98 19.05,53.98
AGND  (via drill 0.6, 1.1, 1.3, 1.3 pad 1.68)
  Top 0.254: 45.21,55.47 ..P$4
  Top 0.356: ..P$17 ..P$16 | ..P$16 ..P$15 | ..P$3 ..P$4 45.22,56.53 arc-90 45.85,57.15 47.5,57.15 | ..P$12 ..P$11 49.77,56.53 arc90 49.15,57.15 47.5,57.15 | ..P$7 47.5,55.45 | 47.5,55.45 47.5,56.13 47.5,57.15 | 47.5,55.45 ..P$8 | ..P$22 47.17,60.45 51.05,60.45 51.05,62.66 ..P$16
  Top 0.61: 72.08,41.4 C25.2 | 56.59,41.4 C23.2 | 41.09,41.4 C5.2 | 25.6,41.4 C3.2 | 10.11,41.4 C1.2 | 47.5,56.13 47.5,50.04 47.37,50.29
  Top 1.016: 72.08,41.4 U$18.P$6 U$18.P$5 74.68,39.88 75.69,40.89 v77.22,40.89 77.98,41.66 C42.2 | 56.59,41.4 U$16.P$6 U$16.P$5 59.18,39.88 60.2,40.89 v61.98,40.89 62.74,41.66 C41.2 | 41.09,41.4 U$12.P$6 U$12.P$5 43.69,39.88 44.7,40.89 v46.23,40.89 46.99,41.66 C40.2 | 25.6,41.4 U$9.P$6 U$9.P$5 28.19,39.88 29.21,40.89 v30.73,40.89 31.5,41.66 C39.2 | 10.11,41.4 U$2.P$6 U$2.P$5 12.7,39.88 13.72,40.89 v15.24,40.89 16,41.66 C38.2 | v92.71,40.89 91.19,40.89 90.17,39.88 U$19.P$5 U$19.P$6 C28.2 | C37.2 2.41,42.55 v2.41,50.29 | 58.93,75.95 JP10.1 | JP10.1 58.93,69.98 | JP10.1 62.1,73.15
  Top 2.184: v39.37,50.29 v31.5,50.29 | v26.16,50.29 v15.37,50.29 | v55.88,50.29 v63.88,50.29 | v69.22,50.29 v77.22,50.29 | v51.94,50.29 47.37,50.29 v43.18,50.29 | v2.41,50.29 2.41,66.42 v3.17,66.42 | JP1.2 92.71,47.12 v92.71,40.89
  Bottom 1.016: U$17.P$1 12.7,37.61 C8.2 | C8.2 10.29,41.02 C10.2 | U$20.P$1 28.19,37.63 C4.2 | C4.2 25.78,41.02 C14.2 | U$22.P$1 43.69,37.66 C15.2 | C15.2 41.28,41.02 C16.2 | U$23.P$1 59.44,37.68 C17.2 | C17.2 57.03,41.02 C18.2 | U$24.P$1 74.68,37.71 C20.2 | C20.2 72.27,41.02 C24.2 | U$25.P$1 90.17,37.73 C26.2 | C26.2 87.76,41.02 C27.2 | 12.7,40.89 C8.2 | v15.24,40.89 12.82,40.89 C8.2 | v30.73,40.89 28.19,40.89 C4.2 | v46.23,40.89 43.69,40.89 C15.2 | v61.98,40.89 59.44,40.89 C17.2 | v77.22,40.89 74.68,40.89 C20.2 | v92.71,40.89 90.17,40.89 C26.2
  Bottom 1.676: v77.22,50.29 v77.22,40.89 | v46.23,40.89 48.64,43.31 48.64,48.51 50.55,50.42 v51.94,50.29 | v61.98,40.89 63.88,42.8 v63.88,50.29 | v30.73,40.89 36.7,46.86 36.7,48.64 38.48,50.42 v39.37,50.29 | v15.24,40.89 21.72,47.37 21.72,49.15 22.86,50.29 26.67,50.29
  Bottom 2.184: v39.37,50.29 v43.18,50.29 | v31.5,50.29 26.67,50.29 v26.16,50.29 | v15.37,50.29 v2.41,50.29 | v51.94,50.29 v55.88,50.29 | v63.88,50.29 v69.22,50.29 | v77.22,50.29 89.54,50.29 JP1.2
  other vias: 3.17,72.39 91.82,66.42 91.82,60.45 15.62,78.87 79.38,78.87 9.65,78.87 3.17,60.45 91.82,72.39 85.34,78.87 73.41,78.87 21.59,78.87 32.64,70.87 32.64,69.47 32.64,68.07 32.64,66.67
  pour Top (isolate 0.61): 95,58.29 0,58.29 0,82.04 95,82.04
  pour Bottom (isolate 0.61): 0,58.29 95,58.29 95,82.04 0,82.04
CH0+
  Top 0.356: ..P$2 43.92,54.36 arc-90 43.41,53.85 20.57,53.85 arc90 C1.1
  Top 1.016: R35.2 C1.1
CH1+
  Top 0.356: 25.65,43.69 C3.1 arc-90 35.31,53.09 45.37,53.09 arc90 45.87,53.59 ..P$5
  Top 1.016: R37.2 C3.1
CH2+
  Top 0.356: C5.1 41.15,50.04 arc-90 43.43,52.32 46.02,52.32 arc90 46.52,52.83 ..P$6
  Top 1.016: C5.1 R39.2
CH3+
  Top 0.356: R41.2 54.1,49.78 arc90 51.56,52.32 48.98,52.32 arc-90 48.47,52.83 ..P$9
  Top 1.016: C23.1 R41.2
CH4+
  Top 0.356: ..P$10 49.12,53.59 arc90 49.63,53.09 59.94,53.09 arc-90 R43.2
  Top 1.016: C25.1 R43.2
CH5+
  Top 0.356: ..P$13 51.07,54.36 arc90 51.58,53.85 74.68,53.85 arc-90 R45.2
  Top 1.016: C28.1 R45.2
GNDA  (via drill 0.6, 1.3)
  Top 0.305: U$3.7 U$3.6 U$3.5 U$3.4 U$3.3 U$3.2
  Top 0.61: D1.C v4.06,13.84
  Top 1.016: 12.2,23.11 R13.2 13.21,25.4 R3.1 13.21,26.92 12.7,27.43 U$2.P$4 U$2.P$3 | 12.2,23.11 R28.2 12.2,20.51 U$3.5 | v14.1,23.11 12.2,23.11
  Top 1.93: JP11.1 9.53,7.75 U$3.3
  Bottom 0.61: v4.06,13.84 4.83,13.08 11.68,13.08 12.57,13.97 12.57,16.64 C2.2
  Bottom 1.016: 8.89,25.4 Q1.3 | Q1.3 11.81,25.3 | 11.81,25.3 13.46,25.3 | R44.2 11.81,25.3 | 13.84,29.99 U$17.P$4 13.46,29.75 13.46,25.3 | 13.46,25.3 13.46,23.11 v14.1,23.11 | Q1.3 8.1,25.3 8,25.4 8,26.67 7.49,27.18 C29.1 9.91,27.18 12.83,30.1 12.83,29.34 10.16,26.67 8.76,26.67 8.51,26.42 8.51,26.16 12.95,26.16 12.95,28.57 12.83,28.7 12.83,28.45 11.05,26.67 12.06,26.67 12.45,27.05
  Bottom 1.422: C2.2 14.1,18.29 v14.1,23.11
GNDB  (via drill 0.6, 1.3)
  Top 0.305: U$4.2 U$4.3 U$4.4 U$4.5 26.29,19.37 25.78,19.88 | U$4.6 U$4.7
  Top 0.61: D3.C v19.56,13.84
  Top 1.016: 25.78,23.11 R29.2 25.78,19.88 U$4.6 | 25.78,23.11 R14.2 26.8,25.4 R5.2 28.19,28.07 U$9.P$4 U$9.P$3 | v27.94,23.11 25.78,23.11
  Top 1.93: JP2.2 25.02,7.17 U$4.3
  Bottom 0.61: v19.56,13.84 20.32,13.08 25.78,13.08 26.54,13.84 C7.2
  Bottom 1.016: 22.86,25.4 Q3.3 | Q3.3 25.78,25.3 | 25.78,25.3 R49.2 | 25.78,25.3 27.43,25.3 | 27.43,25.3 27.43,28.25 U$20.P$4 | 27.43,25.3 27.43,23.11 v27.94,23.11 | Q3.3 22.1,25.3 C30.1 25.4,27.18 28.32,30.1 28.32,29.34 25.27,26.29 23.62,26.29 | 22.86,26.29 23.62,26.29 | 23.62,26.29 24.13,25.78 26.67,25.78 26.92,26.04 26.92,26.92 26.29,26.29
  Bottom 1.422: C7.2 27.64,17.85 27.64,23.19 27.71,23.11 v27.94,23.11
GNDC  (via drill 0.6, 1.3)
  Top 0.305: U$5.7 U$5.6 | 41.28,19.88 41.28,19.61 U$5.5 U$5.4 U$5.3 U$5.2
  Top 0.61: D4.C v35.05,13.84
  Top 1.016: 41.28,23.11 R30.2 41.28,19.88 U$5.6 | 41.28,23.11 R15.2 42.29,25.4 R9.2 43.69,28.07 U$12.P$4 U$12.P$3 | v43.43,23.11 41.28,23.11
  Top 1.93: JP3.1 40.51,7.29 U$5.3
  Bottom 0.61: v35.05,13.84 35.81,13.08 41.27,13.08 42.04,13.84 42.04,16.64 C9.2
  Bottom 1.016: 38.35,25.4 Q4.3 | Q4.3 41.27,25.3 | 41.27,25.3 R54.2 | 41.27,25.3 42.93,25.3 | 42.93,25.3 42.93,28.28 U$22.P$4 | 42.93,25.3 42.93,23.11 v43.43,23.11 | Q4.3 37.59,25.3 C31.1 40.89,27.18 43.81,30.1 43.81,29.34 41.02,26.54 38.1,26.54 37.85,26.29 38.99,26.29 39.37,25.91 42.29,25.91 42.42,26.04 42.42,27.18 41.66,26.42
  Bottom 1.422: C9.2 43.13,17.85 43.13,23.39 43.41,23.11 v43.43,23.11
GNDD  (via drill 0.6, 1.3)
  Top 0.305: U$6.7 U$6.6 U$6.5 U$6.4 U$6.3 U$6.2
  Top 0.61: D5.C v50.55,13.84
  Top 1.016: 56.77,23.11 R31.2 56.77,19.88 U$6.6 | 56.77,23.11 R16.2 57.78,25.4 R11.2 59.18,28.07 U$16.P$4 U$16.P$3 | v58.93,23.11 56.77,23.11
  Top 1.93: JP5.2 56.01,7.78 U$6.3
  Bottom 0.61: v50.55,13.84 51.31,13.08 56.77,13.08 57.53,13.84 C11.2
  Bottom 1.016: 53.85,25.4 Q5.3 | Q5.3 56.77,25.3 | 56.77,25.3 R58.2 | 56.77,25.3 58.42,25.3 | 58.42,25.3 58.42,28.3 U$23.P$4 | 58.42,25.3 58.42,23.11 v58.93,23.11 | Q5.3 53.09,25.3 C32.1 56.39,27.18 59.31,30.1 59.31,29.21 56.64,26.54 53.98,26.54 53.72,26.29 54.61,26.29 54.99,25.91 57.4,25.91 57.66,26.16 57.66,26.8 57.78,26.92
  Bottom 1.422: C11.2 58.62,17.85 58.62,23.27 58.78,23.27 v58.93,23.11
GNDE  (via drill 0.6, 1.3)
  Top 0.305: U$7.7 U$7.6 | U$7.6 U$7.3 | U$7.3 U$7.4 | U$7.3 U$7.2 | U$7.5 U$7.6
  Top 0.61: D6.C v66.04,13.84
  Top 1.016: 72.27,23.11 R33.2 72.27,19.88 U$7.6 | 72.27,23.11 R17.2 73.28,25.4 R27.2 74.68,28.07 U$18.P$4 U$18.P$3 | v74.42,23.11 72.27,23.11
  Top 1.93: JP6.1 71.5,8.28 U$7.3
  Bottom 0.61: v66.04,13.84 66.8,13.08 72.26,13.08 73.03,13.84 C12.2
  Bottom 1.016: 72.26,25.3 Q6.3 68.58,25.3 C33.1 71.88,27.18 74.8,30.1 74.8,29.72 71.75,26.67 69.34,26.67 69.09,26.42 69.09,26.16 73.66,26.16 73.66,26.92 73.15,27.43 73.15,27.05 72.77,26.67 | 72.26,25.3 73.88,25.3 | R62.2 72.26,25.3 | 73.88,25.3 73.88,28.3 U$24.P$4 | 73.88,25.3 73.88,23.11 v74.42,23.11
  Bottom 1.422: C12.2 74.09,17.83 74.09,23.39 74.14,23.39 v74.42,23.11
GNDF  (via drill 0.6, 1.3)
  Top 0.305: U$8.3 U$8.6 | U$8.6 U$8.5 | U$8.4 U$8.3 | U$8.3 U$8.2 | U$8.7 U$8.6
  Top 0.61: D7.C v81.53,13.84
  Top 1.016: U$8.6 85.86,20.25 R34.2 R18.2 86.87,25.4 R38.2 87.58,27.38 U$19.P$3 U$19.P$4 v90.17,26.92
  Top 1.93: JP12.2 87,8.81 U$8.3
  Bottom 0.61: v81.53,13.84 82.3,13.08 87.76,13.08 88.52,13.84 C13.2
  Bottom 1.016: 91.25,17.59 94.23,20.57 94.23,25.91 91.19,28.96 91.17,28.94 | 91.25,17.59 90.42,16.76 C13.2 | 91.15,30.1 U$25.P$4 | R66.2 90.04,18.8 91.25,17.59 | 91.17,28.94 U$25.P$4 | U$25.P$4 91.19,30.09 | 91.17,28.94 v90.17,26.92 88.52,26.29 87.53,25.3 Q7.3 84.07,25.3 C36.1 87.38,27.18 90.3,30.1 90.3,29.72 87.38,26.8 85.09,26.8 84.58,26.29 86.11,26.29 86.23,26.42
N$1
  Bottom 0.203: 13.72,29.97 14.86,29.97 14.86,23.37
N$2
  Bottom 1.422: 27.43,17.65 29.72,19.94 29.72,29.59 28.45,28.32 28.45,24.26 28.57,24.13 28.57,19.56
N$3
  Top 0.356: ..P$21 47.82,64.08 49.15,65.41 52.96,65.41 53.85,66.29 R32.1
N$4
  Bottom 1.422: 42.8,17.53 45.21,19.94 45.21,29.72 43.94,28.45 43.94,19.68
N$5
  Top 0.356: ..P$1 43.27,56.17 arc90 C19.2
  Top 0.61: R19.1 C19.2
N$6
  Bottom 1.422: 58.42,17.65 60.71,19.94 60.71,29.84 59.44,28.57 59.44,26.04 59.56,25.91 59.56,19.81
N$7
  Bottom 1.016: R42.2 9.99,20.83 Q1.1 11.81,22.7 R44.1
N$8
  Top 0.356: ..P$14 51.72,56.42 arc-90 C22.1
N$9
  Top 0.356: ..P$28 43.27,64.68 42.55,65.41 40.26,65.41 R20.1
  Top 1.016: C21.1 38.1,66.55 R20.1
N$10
  Top 0.356: ..P$27 43.92,65.29 43.04,66.17 41.78,66.17 41.15,66.8 R21.1
N$11
  Top 0.356: ..P$26 44.57,66.68 R22.1
N$12
  Top 0.356: ..P$25 45.22,64.91 46.23,65.91 R23.1
N$13
  Top 0.356: ..P$24 45.87,64.42 48.77,67.31 R24.1
N$14
  Top 0.356: ..P$23 46.52,63.92 48.77,66.17 50.67,66.17 51.31,66.8 R25.1
N$15
  Top 0.356: ..P$18 49.77,64 50.42,64.64 54.48,64.64 56.39,66.55 R26.1
N$16
  Bottom 1.016: Q1.2 7.79,20.83 R40.2
N$17
  Bottom 1.016: U$20.P$2 27.39,35.09 22.78,39.7 22.78,40.69 | 22.78,40.69 L3.1 | C14.1 22.78,40.69
N$18  (via drill 0.6)
  Top 0.61: v5.46,17.02 4.92,17.56 D1.A
  Bottom 0.61: R46.2 7.75,16.13 6.86,17.02 v5.46,17.02
N$19
  Bottom 1.422: 73.66,17.4 76.2,19.94 76.2,29.97 74.93,28.7 74.93,27.3 74.98,27.13 74.98,19.81
N$20
  Bottom 1.422: 91.14,29.67 90.47,29.67 86.51,25.7
N$21
  Bottom 1.016: 13.31,17.27 13.36,17.27 14.45,18.36 14.45,24.51
N$22
  Top 1.016: R45.1 U$19.P$7
N$23
  Top 1.016: U$18.P$7 R43.1
N$24
  Top 1.016: U$16.P$7 R41.1
N$25
  Top 1.016: U$12.P$7 R39.1
N$26
  Bottom 1.422: 87.05,25.73 87.5,26.19 92.38,26.19 94.03,24.54 | 90.86,29.74 91.72,29.74 91.72,28.68 94.03,26.36 94.03,24.54 | 94.03,24.54 94.03,22 90.7,18.67 90.3,18.67 90.3,17.53
N$27
  Bottom 1.422: 89.28,27.3 92.33,27.3 92.48,27.15 92.15,27.15 91.21,28.09
N$28
  Top 1.016: R19.2 35.81,60.71 30.48,66.04 C34.1 L1.1
N$29
  Top 0.61: R3.2 7.49,26.67 | 7.49,26.67 R1.1 | U$2.P$2 7.62,26.8 7.49,26.67
N$30
  Top 0.61: R5.1 23.11,26.67 | 23.11,26.67 21.08,26.67 R4.1 | U$9.P$2 23.11,26.67
N$31
  Top 0.61: R9.1 38.61,26.67 | 38.61,26.67 36.58,26.67 R7.1 | U$12.P$2 38.61,26.67
N$32
  Top 0.61: R11.1 54.1,26.67 | 54.1,26.67 52.07,26.67 R10.1 | U$16.P$2 54.1,26.67
N$33
  Top 1.016: U$9.P$7 R37.1
N$34
  Top 1.016: U$2.P$7 R35.1
N$35
  Bottom 1.016: R48.2 23.96,20.83 Q3.1 25.78,22.7 R49.1
N$36
  Bottom 1.016: Q3.2 21.76,20.83 R47.2
N$37  (via drill 0.6)
  Top 0.61: v20.95,17.02 20.41,17.56 D3.A
  Bottom 0.61: R51.2 21.72,16.26 v20.95,17.02
N$38
  Bottom 1.422: 13.77,21.74 13.77,18.47 12.65,17.35 12.65,20.6 13.87,21.82
N$39
  Top 0.61: R27.1 69.6,26.67 | 69.6,26.67 67.56,26.67 R12.1 | U$18.P$2 69.6,26.67
N$40
  Top 0.61: R36.1 81.15,26.67 R38.1 85.09,26.92 U$19.P$2
N$42
  Bottom 1.016: R54.1 41.27,22.7 Q4.1 39.45,20.83 R53.2
N$43
  Bottom 1.016: Q4.2 37.25,20.83 R52.2
N$44  (via drill 0.6)
  Top 0.61: v36.45,17.02 35.91,17.56 D4.A
  Bottom 0.61: R55.2 37.21,16.26 v36.45,17.02
N$46
  Bottom 1.778: 82.8,53.98 D2.A | JP1.1 90.04,53.98
  Bottom 3.048: 82.8,53.98 90.04,53.98 90.17,53.98
N$47
  Bottom 1.016: R58.1 56.77,22.7 Q5.1 54.95,20.83 R57.2
N$48
  Bottom 1.016: Q5.2 52.75,20.83 R56.2
N$49  (via drill 0.6)
  Top 0.61: v51.94,17.02 51.4,17.56 D5.A
  Bottom 0.61: R59.2 52.7,16.26 v51.94,17.02
N$51
  Top 0.61: JP7.1 84.45,11.23 U$8.1 U$8.8 84.45,20.07 83.44,21.08 83.44,21.46 R34.1 R18.1 83.06,24.26 R36.2
N$53
  Top 0.61: JP6.2 68.96,10.74 U$7.1 U$7.8 68.96,21.34 R33.1 R17.1 69.47,24.26 R12.2
N$54
  Top 0.61: JP4.1 53.47,10.24 U$6.1 U$6.8 53.47,21.34 R31.1 R16.1 53.97,24.26 R10.2
N$55
  Bottom 1.016: R61.2 70.44,20.83 Q6.1 72.26,22.7 R62.1
N$56
  Bottom 1.016: Q6.2 68.24,20.83 R60.2
N$57
  Top 0.61: JP3.2 37.97,9.75 U$5.1 U$5.8 37.97,21.34 R30.1 R15.1 38.48,24.26 R7.2
N$58
  Top 0.61: JP8.1 22.48,9.27 U$4.1 U$4.8 22.48,21.34 R29.1 R14.1 22.98,24.26 R4.2
N$59  (via drill 0.6)
  Top 0.61: v67.44,17.14 66.89,17.56 D6.A
  Bottom 0.61: R63.2 68.2,16.38 v67.44,17.14
N$60
  Top 0.61: JP11.2 6.99,8.68 U$3.1 U$3.8 6.99,20.83 8,21.84 R28.1 R13.1 9.39,24.26 R1.2
N$63
  Bottom 1.016: Q7.1 85.94,20.83 R65.2 87.38,20.83 87.88,20.32 R66.1
N$64
  Bottom 1.016: Q7.2 83.74,20.83 R64.2
N$65  (via drill 0.6)
  Top 0.61: v82.93,17.14 82.52,17.56 D7.A
  Bottom 0.61: R67.2 83.69,16.38 v82.93,17.14
N$74
  Bottom 1.016: U$25.P$2 89.27,35.19 84.76,39.7 84.76,40.89 | 84.76,40.89 L7.1 | C27.1 84.76,40.89
N$76
  Bottom 1.016: U$24.P$2 73.8,35.17 69.27,39.7 69.27,40.89 | 69.27,40.89 L6.1 | C24.1 69.27,40.89
N$78
  Bottom 1.016: U$23.P$2 58.58,35.14 54.03,39.7 54.03,40.89 | 54.03,40.89 L5.1 | C18.1 54.03,40.89
N$80
  Bottom 1.016: U$17.P$2 11.92,35.07 7.29,39.7 7.29,40.89 | 7.29,40.89 L2.1 | C10.1 7.29,40.89
N$82
  Bottom 1.016: U$22.P$2 42.86,35.12 38.28,39.7 38.28,40.89 | 38.28,40.89 L4.1 | C16.1 38.28,40.89
NRST
  Top 1.016: R21.2 JP9.3
PA3
  Top 1.016: R26.2 JP10.2
PA4
  Top 1.016: R25.2 JP10.4
PA5
  Top 1.016: R24.2 JP10.5
PA6
  Top 1.016: R23.2 JP9.1
PA7
  Top 1.016: R22.2 JP9.2
PB0
  Top 1.016: R32.2 JP10.3
VCCA  (via drill 1.1)
  Top 1.016: U$2.P$1 5.08,28.45 v3.3,28.45
  Bottom 1.016: 4.57,28.45 C29.2 3.3,27.18 0.76,24.64 0.76,21.34 3.3,18.8 R40.1 R42.1 9.91,16.76 C2.1 R46.1 | 4.57,28.45 4.57,29.99 U$17.P$5 | v3.3,28.45 4.57,28.45
VCCB  (via drill 1.1)
  Top 1.016: U$9.P$1 20.57,28.45 v18.92,28.45
  Bottom 1.016: 20.07,28.45 C30.2 20.07,19.56 20.83,18.8 R47.1 R48.1 23.88,16.76 C7.1 R51.1 | 20.07,28.45 20.07,30.01 U$20.P$5 | v18.92,28.45 20.07,28.45
VCCC  (via drill 1.1)
  Top 1.016: U$12.P$1 36.07,28.45 v34.42,28.45
  Bottom 1.016: 35.56,28.45 C31.2 35.56,19.56 36.32,18.8 R52.1 R53.1 39.37,16.76 C9.1 R55.1 | 35.56,28.45 35.56,30.04 U$22.P$5 | v34.42,28.45 35.56,28.45
VCCD  (via drill 1.1)
  Top 1.016: U$16.P$1 51.56,28.45 v49.91,28.45
  Bottom 1.016: 51.05,28.45 C32.2 51.05,19.56 51.82,18.8 R56.1 R57.1 54.86,16.76 C11.1 R59.1 | 51.05,28.45 51.05,30.06 U$23.P$5 | v49.91,28.45 51.05,28.45
VCCE  (via drill 1.1)
  Top 1.016: U$18.P$1 67.06,28.45 v65.41,28.45
  Bottom 1.016: 66.55,28.45 C33.2 66.55,19.56 67.31,18.8 R60.1 R61.1 70.36,16.76 C12.1 R63.1 | 66.55,28.45 66.55,30.09 U$24.P$5 | v65.41,28.45 66.55,28.45
VCCF  (via drill 1.1)
  Top 1.016: U$19.P$1 82.55,28.45 v80.9,28.45
  Bottom 1.016: 82.04,28.45 C36.2 82.04,19.56 82.8,18.8 R64.1 R65.1 85.85,16.76 C13.1 R67.1 | 82.04,28.45 82.04,30.11 U$25.P$5 | v80.9,28.45 82.04,28.45
(copper drawn outside any net)
  shapes: Bottom area x5, Bottom circle x2, Top area x6, Top circle x2

### Text on the board
tPlace: +5V | +3.3V | RESET | SDI | SDO | SCK | CS | OSC1 | /DRA | GND | C15 | CON1 | L1 | C17 | C16 | C18 | R32 | R33 | R34 | R35 | R36 | R37 | R38 | R39 | C13 | R31 | C14 | +12V | GND | R25 | C2 | R26 | C4 | R27 | C6 | R28 | C8 | R29 | C10 | R30 | C12 | C1 | C3 | C5 | C7 | C9 | C11 | U7 | U8 | U9 | U10 | U11 | U12 | R2 | R6 | R10 | R14 | R18 | R22 | R1 | R23 | R3 | R5 | R7 | R9 | R11 | R13 | R15 | R17 | R19 | R4 | R8 | R12 | R16 | R20 | R21 | R24 | U1 | U2 | U3 | U4 | U5 | U6 | LED1 | LED2 | LED3 | LED4 | LED5 | LED6 | A | G | B | G | C | G | a | G | b | G | c | G
bPlace: Made in | China | Designed in | Romania | L7 | L6 | L5 | L4 | L3 | L2 | C41 | C39 | C37 | C35 | C33 | C31 | C42 | C40 | C38 | C36 | C34 | C32 | U | T6 | T5 | T4 | T3 | T2 | T1 | C30 | C28 | C26 | C24 | C22 | C20 | R61 | R58 | R55 | R52 | R49 | R47 | R63 | R62 | R60 | R59 | R57 | R56 | R54 | R53 | R51 | R50 | R48 | R46 | C29 | C27 | C25 | C23 | C21 | C19 | R45 | R44 | R43 | R42 | R41 | R40